# EAGLE schematic arduino_semaphore_ (EAGLE 6.2)
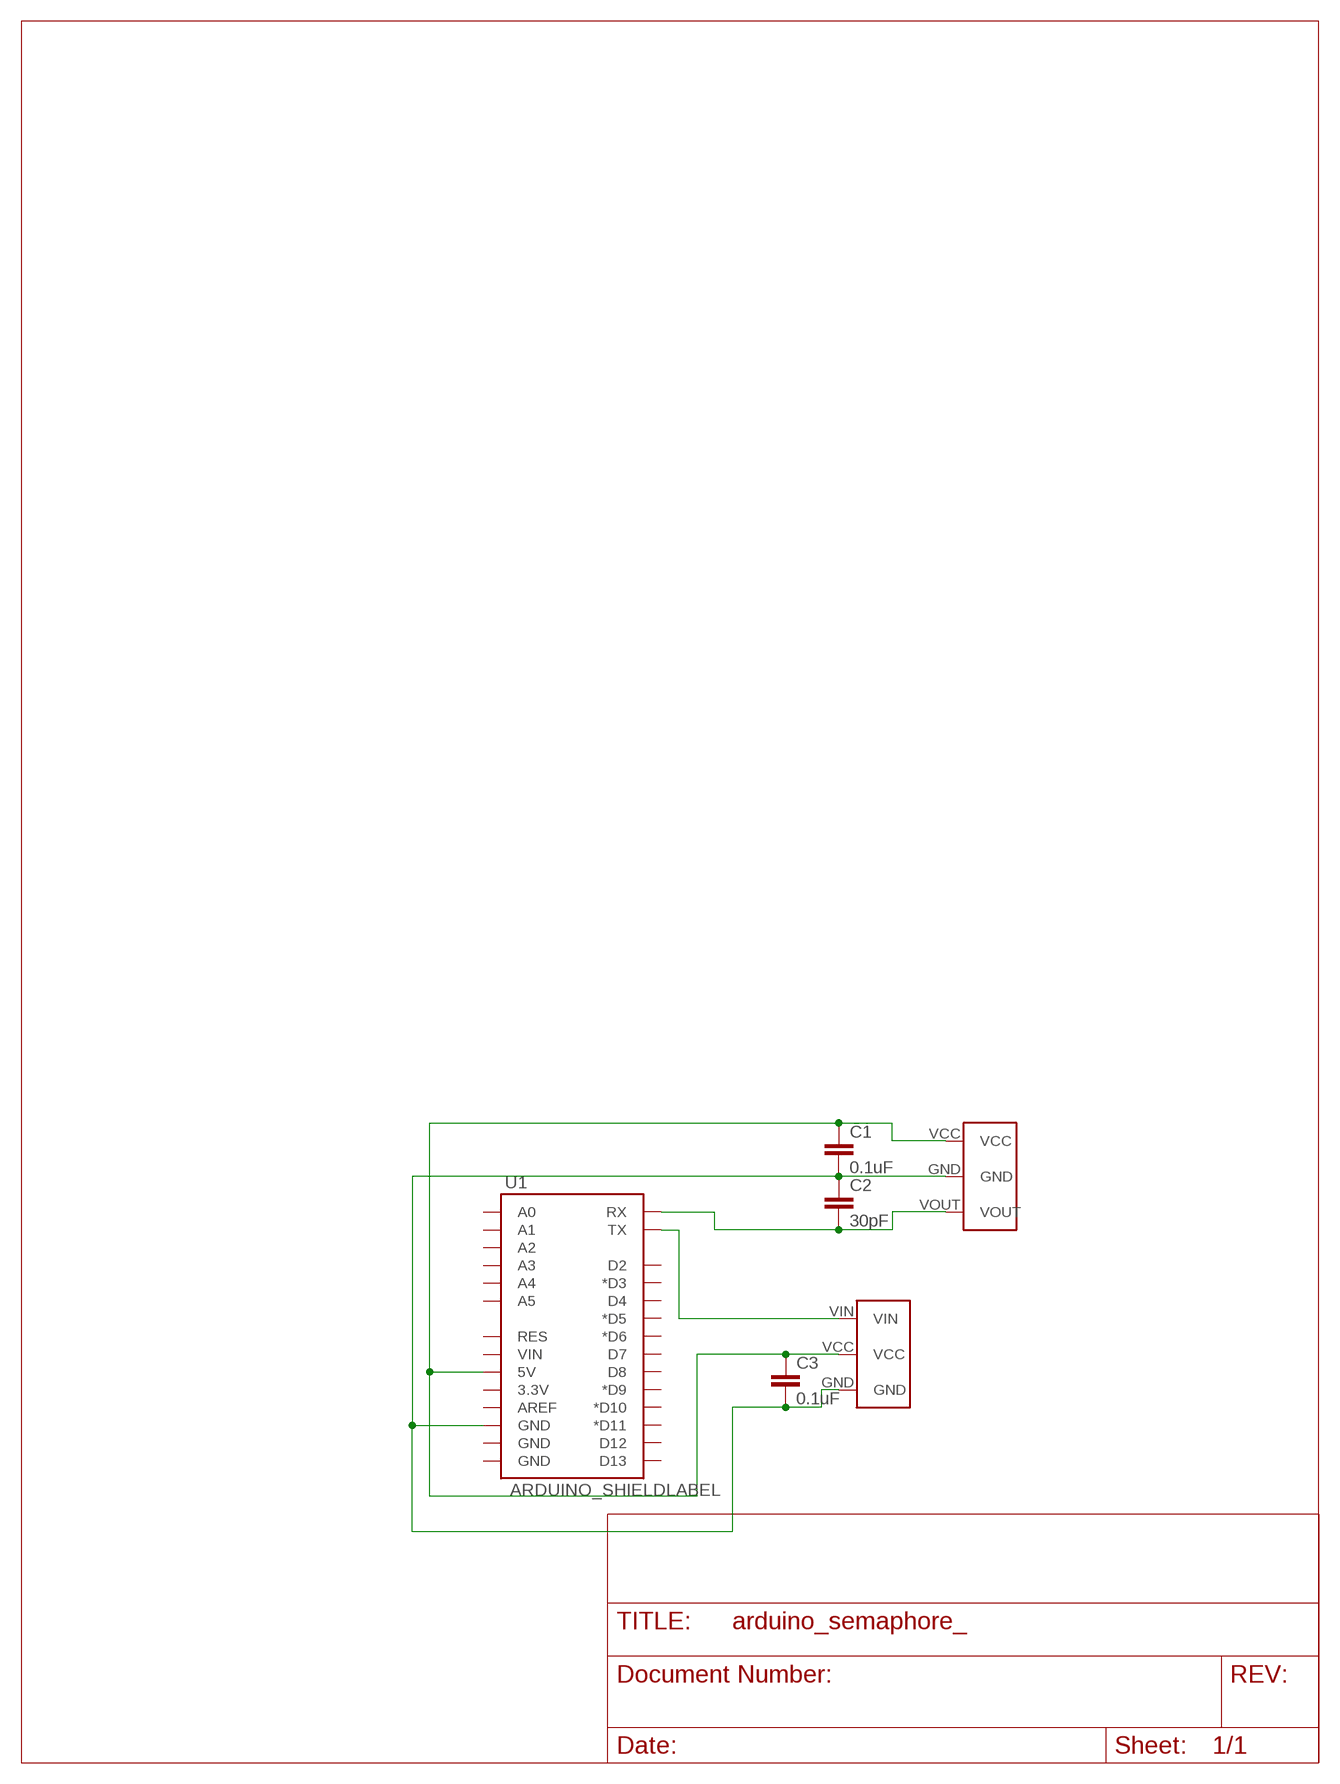
[diagram p0: schematic, sheet 1]

## Parts
C1  0.1uF  CAP0805  [0805]
C2  30pF  CAP0805  [0805]
C3  0.1uF  CAP0805  [0805]
U1  ARDUINO_SHIELDLABEL  [DUEMILANOVE_SHIELD]
U$1  DLR1160  [DLR]
U$2  DLT1160  [DLT]

## Nets
N$2: C2.2 U1.RX U$1.VOUT
N$4: C1.1 C3.1 U1.5V U$1.VCC U$2.VCC
N$5: C1.2 C2.1 C3.2 U1.GND@2(GND) U$1.GND U$2.GND
N$6: U1.TX U$2.VIN
Unconnected: U1.3.3V U1.A0 U1.A1 U1.A2 U1.A3 U1.A4 U1.A5 U1.AREF U1.D2 U1.D3(*D3) U1.D4 U1.D5(*D5) U1.D6(*D6) U1.D7 U1.D8 U1.D9(*D9) U1.D10(*D10) U1.D11(*D11) U1.D12 U1.D13 U1.GND@0(GND) U1.GND@1(GND) U1.RES U1.VIN

## Library data of the parts
C1-C3 = SparkFun-Passives:CAP: Capacitor Standard 0603 ceramic capacitor, and 0.1" leaded capacitor.
U1 = SparkFun-Boards:ARDUINO_SHIELD: Arduino shield footprint
U$1 = TOS:DLR1160
U$2 = TOS:DLT1160